# Altium project snes_hook.PrjPcb
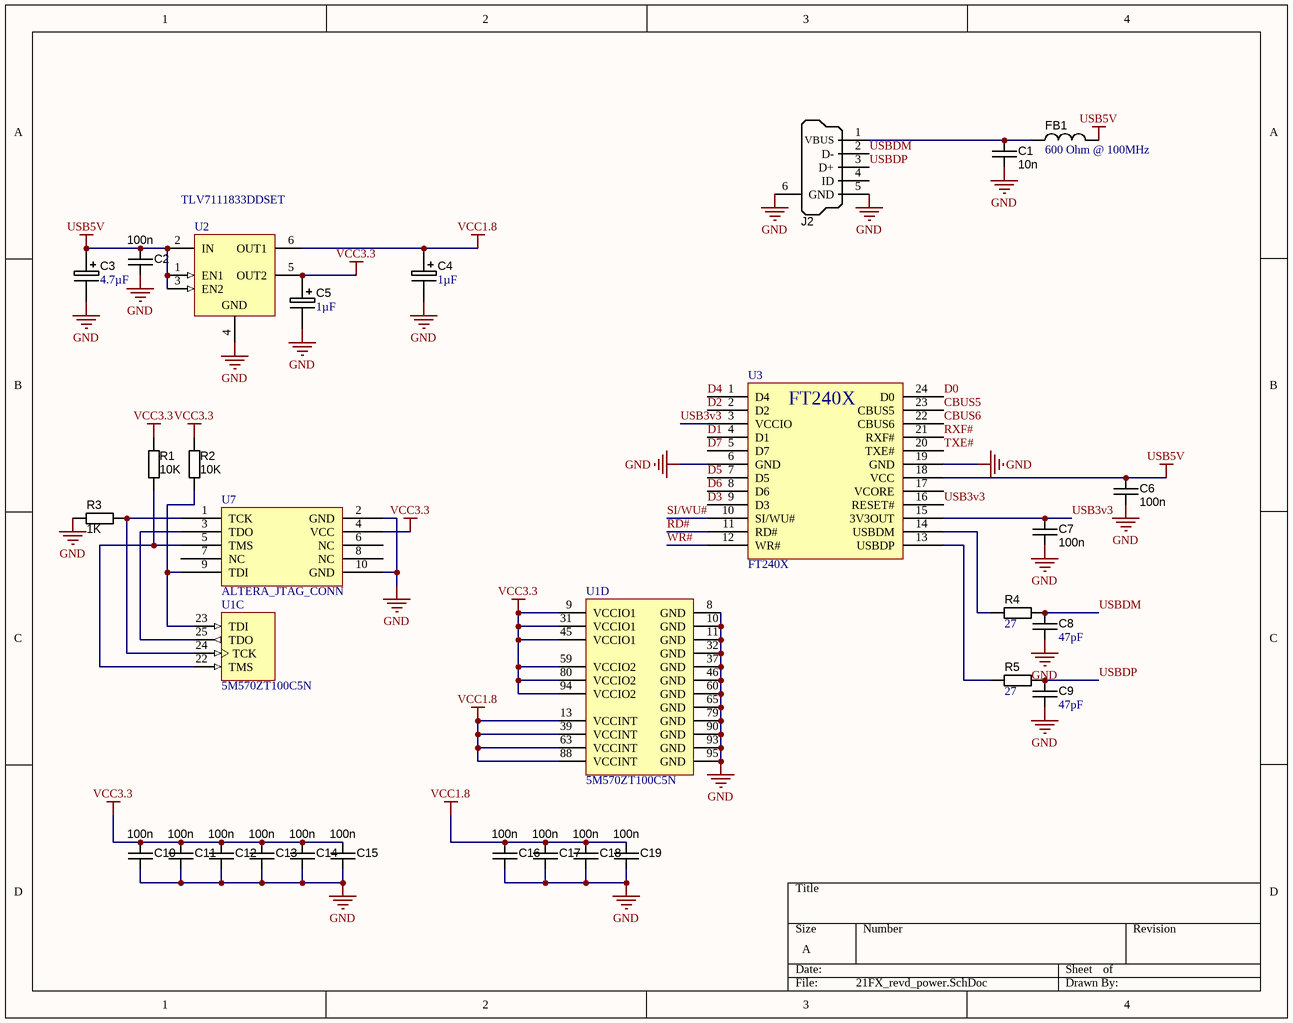
[diagram p0: 21FX_revd_power.SchDoc]
2 sheets, 44 parts. Net scope: global (net labels, ports and power ports of the same name join across sheets).
Board file: 21FX_revd.PcbDoc
Sheets:
  21FX_revd_power.SchDoc
  21FX_revd.SchDoc

## Sheet 21FX_revd_power.SchDoc
size A

### Parts
C1  value 10n  [CAPC1608X90N]  (hidden comment: approved sub OK)
C2  value 100n  [CAPC1608X90N]  (hidden comment: approved sub OK)
C3  Capacitance: 4.7µF  [CAPC1608X90N]
C4  Capacitance: 1µF  [CAPC1608X90N]
C5  Capacitance: 1µF  [CAPC1608X90N]
C6  value 100n  [CAPC1608X90N]  (hidden comment: approved sub OK)
C7  value 100n  [CAPC1608X90N]  (hidden comment: approved sub OK)
C8  Capacitance: 47pF  [CAPC1608X90N]
C9  Capacitance: 47pF  [CAPC1608X90N]
C10  value 100n  [CAPC1608X90N]  (hidden comment: approved sub OK)
C11  value 100n  [CAPC1608X90N]  (hidden comment: approved sub OK)
C12  value 100n  [CAPC1608X90N]  (hidden comment: approved sub OK)
C13  value 100n  [CAPC1608X90N]  (hidden comment: approved sub OK)
C14  value 100n  [CAPC1608X90N]  (hidden comment: approved sub OK)
C15  value 100n  [CAPC1608X90N]  (hidden comment: approved sub OK)
C16  value 100n  [CAPC1608X90N]  (hidden comment: approved sub OK)
C17  value 100n  [CAPC1608X90N]  (hidden comment: approved sub OK)
C18  value 100n  [CAPC1608X90N]  (hidden comment: approved sub OK)
C19  value 100n  [CAPC1608X90N]  (hidden comment: approved sub OK)
FB1  Impedance @ Frequency: 600 Ohm @ 100MHz  [FBC2012N]
J2  USB_Mini-B_TH  [USB_MINI-B_WURTH-TH]  (value not drawn)
R1  value 10K  [RESC1608X55N]  (hidden comment: Thick Film)
R2  value 10K  [RESC1608X55N]  (hidden comment: Thick Film)
R3  value 1K  [RESC1608X55N]  (hidden comment: Thick Film)
R4  Resistance (Ohms): 27  [RESC1608X55N]  (hidden comment: Thick Film)
R5  Resistance (Ohms): 27  [RESC1608X55N]  (hidden comment: Thick Film)
U1  5M570ZT100C5N  [TQFP100_A-120_N]  (parts C,D of 4)
U2  TLV7111833DDSET  [TI-DSE6_V]
U3  FT240X  [SSOP-24]
U7  ALTERA_JTAG_CONN  [JTAG_CONN]

### Nets
GND: C1.2 C2.2 C3.2 C4.2 C5.2 C6.2 C7.2 C8.2 C9.2 C10.2 C11.2 C12.2 C13.2 C14.2 C15.2 C16.2 C17.2 C18.2 C19.2 J2.5(GND) J2.6(Shell) R3.1 U1.8(GND) U1.10(GND) U1.11(GND) U1.32(GND) U1.37(GND) U1.46(GND) U1.60(GND) U1.65(GND) U1.79(GND) U1.90(GND) U1.93(GND) U1.95(GND) U2.4(GND) U3.6(GND) U3.19(GND) U7.2(GND) U7.10(GND)
USB5V: C2.1 C3.1 C6.1 FB1.2 U2.1(EN1) U2.2(IN) U2.3(EN2) U3.18(VCC)
VCC1.8: C4.1 C16.1 C17.1 C18.1 C19.1 U1.13(VCCINT) U1.39(VCCINT) U1.63(VCCINT) U1.88(VCCINT) U2.6(OUT1)
VCC3.3: C5.1 C10.1 C11.1 C12.1 C13.1 C14.1 C15.1 R1.1 R2.1 U1.9(VCCIO1) U1.31(VCCIO1) U1.45(VCCIO1) U1.59(VCCIO2) U1.80(VCCIO2) U1.94(VCCIO2) U2.5(OUT2) U7.4(VCC)
CBUS5: U3.23(CBUS5)
CBUS6: U3.22(CBUS6)
D0: U3.24(D0)
D1: U3.4(D1)
D2: U3.2(D2)
D3: U3.9(D3)
D4: U3.1(D4)
D5: U3.7(D5)
D6: U3.8(D6)
D7: U3.5(D7)
RD#: U3.11(RD#)
RXF#: U3.21(RXF#)
SI/WU#: U3.10(SI/WU#)
TXE#: U3.20(TXE#)
USB3v3: C7.1 U3.3(VCCIO) U3.15(3V3OUT) U3.16(RESET#)
USBDM: C8.1 J2.2(D-) R4.2
USBDP: C9.1 J2.3(D+) R5.2
WR#: U3.12(WR#)
NetC1_1: C1.1 FB1.1 J2.1(VBUS)
NetR1_2: R1.2 U1.22(TMS) U7.5(TMS)
NetR2_2: R2.2 U1.23(TDI) U7.9(TDI)
NetR3_2: R3.2 U1.24(TCK) U7.1(TCK)
NetR4_1: R4.1 U3.14(USBDM)
NetR5_1: R5.1 U3.13(USBDP)
NetU1_25: U1.25(TDO) U7.3(TDO)

Not connected (* = marked no-connect by the designer): J2 4(ID); U3 17(VCORE); U7 6(NC) 7(NC) 8(NC)

### Library data of the parts
C1 = CAPC_10n_0603_X7R_50V_10%: Capacitor SMD Cer 10nF 10% 50V X7R 0603; Manufacturer 1: TDK Corporation; Manufacturer Part Number 1: C1608X7R1H103K; Ratings: 50V; X7R; Material: ceramic; SCDType: spec; Package / Case: 0603 (1608 metric); Tolerance: ±10%; Supplier 1: Digi-Key; Supplier Part Number 1: 445-1311-1-ND; ComponentLink1URL: http://product.tdk.com/capacitor/mlcc/en/documents/mlcc_commercial_general_en.pdf; ComponentLink1Description: http://product.tdk.com/capacitor/mlcc/en/documents/mlcc_commercial_general_en.pdf; Supplier 2: Digi-Key; Supplier Part Number 2: 478-1227-1-ND; Manufacturer 2: AVX Corporation; Manufacturer Part Number 2: 06035C103KAT2A; ComponentLink2URL: http://www.avx.com/docs/Catalogs/cx7r.pdf; ComponentLink2Description: http://www.avx.com/docs/Catalogs/cx7r.pdf
C2 C6 C7 C10-C19 = CAPC_100n_0603_X7R_50V_10%: Capacitor SMD Cer 100nF 10% 50V X7R 0603; Manufacturer 1: AVX Corporation; Manufacturer Part Number 1: 06035C104KAT2A; Ratings: 50V; X7R; Material: ceramic; SCDType: spec; Manufacturer 2: TDK Corporation; Manufacturer Part Number 2: C1608X7R1H104K; Package / Case: 0603 (1608 Metric); Tolerance: ±10%; Supplier 1: Digi-Key; Supplier Part Number 1: 478-5052-1-ND; ComponentLink1URL: http://www.avx.com/docs/Catalogs/cx7r.pdf; ComponentLink1Description: http://www.avx.com/docs/Catalogs/cx7r.pdf; Supplier 2: Digi-Key; Supplier Part Number 2: 445-1314-1-ND; ComponentLink2URL: http://product.tdk.com/capacitor/mlcc/en/documents/mlcc_commercial_general_en.pdf; ComponentLink2Description: http://product.tdk.com/capacitor/mlcc/en/documents/mlcc_commercial_general_en.pdf
C3 = CAPT_4_7u_0603_10V: Capacitor SMD 4.7uF 10% 10V; Manufacturer: Yageo; Manufacturer Part Number: CC0603KRX5R6BB475; Temperature Coefficient: X5R; Supplier 1: Digi-Key; RoHS: RoHS Compliant; Category: Capacitors; Stock 1: 132000; Pricing 1: 4000=0.02154, 8000=0.02003, 12000=0.01903, 28000=0.01803, 100000=0.01365 (USD); Packaging: Tape & Reel (TR); Tolerance: ±10%; Voltage - Rated: 10V; Mounting Type: Surface Mount, MLCC; Operating Temperature: -55°C ~ 85°C; Applications: General Purpose; Ratings: -; Package / Case: 0603 (1608 Metric); Size / Dimension: 0.063" L x 0.031" W (1.60mm x 0.80mm); Height - Seated (Max): -; Thickness (Max): 0.035" (0.90mm); Lead Spacing: -; Features: -; Lead Style: -; ComponentLink1URL: http://www.yageo.com/documents/recent/UPY-GPHC_X5R_4V-to-50V-21.pdf; ComponentLink1Description: http://www.yageo.com/documents/recent/UPY-GPHC_X5R_4V-to-50V-21.pdf; Supplier Part Number 1: 311-1455-2-ND
C4 C5 = CAPT_1u_0603_10V: Capacitor SMD 1uF 10% 10V; Manufacturer: Murata Electronics North America; Manufacturer Part Number: GRM155R61A105KE15D; Temperature Coefficient: X5R; Supplier 1: Digi-Key; RoHS: RoHS Compliant; Category: Capacitors; Stock 1: 2730000; Pricing 1: 10000=0.0042, 20000=0.004, 30000=0.0038, 50000=0.0034, 100000=0.00275 (USD); Packaging: Tape & Reel (TR); Tolerance: ±10%; Voltage - Rated: 10V; Mounting Type: Surface Mount, MLCC; Operating Temperature: -55°C ~ 85°C; Applications: General Purpose; Ratings: -; Package / Case: 0402 (1005 Metric); Size / Dimension: 0.039" L x 0.020" W (1.00mm x 0.50mm); Height - Seated (Max): -; Thickness (Max): 0.022" (0.55mm); Lead Spacing: -; Features: -; Lead Style: -; ComponentLink1URL: http://www.murata.com/~/media/webrenewal/support/library/catalog/products/capacitor/mlcc/c02e.pdf; ComponentLink1Description: http://www.murata.com/~/media/webrenewal/support/library/catalog/products/capacitor/mlcc/c02e.pdf; Supplier Part Number 1: 490-3890-2-ND
C8 C9 = CAPC_47p_0603_X7R_50V_5%: Capacitor SMD Cer 47pF 5% 50V X7R 0603; Manufacturer 1: Samsung Electro-Mechanics America, Inc.; Manufacturer Part Number 1: CL10C470JB8NCNC; Description 1: CAP CER 47PF 50V NP0 0603; Temperature Coefficient: C0G, NP0; Supplier 1: Digi-Key; RoHS 1: RoHS Compliant; Category 1: Capacitors; Stock 1: 128540; Pricing 1: 1=0.1, 10=0.027, 25=0.0192, 50=0.0148, 100=0.0125, 500=0.00878, 1000=0.00684 (USD); Packaging: Cut Tape (CT); Tolerance: ±5%; Voltage - Rated: 50V; Mounting Type: Surface Mount, MLCC; Operating Temperature: -55°C ~ 125°C; Applications: General Purpose; Ratings: -; Package / Case: 0603 (1608 Metric); Size / Dimension: 0.063" L x 0.031" W (1.60mm x 0.80mm); Height - Seated (Max): -; Thickness (Max): 0.035" (0.90mm); Lead Spacing: -; Features: -; Lead Style: -; ComponentLink1URL: http://media.digikey.com/pdf/Data%20Sheets/Samsung%20PDFs/CL10C470JB8NCNC_Spec.pdf; ComponentLink1Description: http://media.digikey.com/pdf/Data%20Sheets/Samsung%20PDFs/CL10C470JB8NCNC_Spec.pdf; Supplier Part Number 1: 1276-2296-1-ND
FB1 = FERRITE_600-100MHz_0805: Ferrite bead 600 Ohm at 100 MHz 1.5A 0805 SMD; Manufacturer 1: Laird-Signal Integrity Products; Manufacturer Part Number 1: MI0805K601R-10; Description 1: FERRITE BEAD 600 OHM 0805; Category 1: Filters; Filter Type: Power Line; Number of Lines: 1; DC Resistance (DCR) (Max): 100 mOhm; Supplier 1: Digi-Key; RoHS 1: RoHS Compliant; Stock 1: 564000; Pricing 1: 4000=0.0225, 8000=0.021, 12000=0.0195, 28000=0.01928, 100000=0.01875 (USD); Packaging: Tape & Reel (TR); Current Rating (Max): 1.5A; Ratings: -; Operating Temperature: -40°C ~ 125°C; Package / Case: 0805 (2012 Metric); Mounting Type: Surface Mount; Height (Max): 0.043" (1.10mm); Size / Dimension: 0.079" L x 0.049" W (2.00mm x 1.25mm); ComponentLink1URL: http://media.digikey.com/pdf/Data%20Sheets/Steward%20PDFs/FerriteEMI_ChipBeads_br.pdf; ComponentLink1Description: http://media.digikey.com/pdf/Data%20Sheets/Steward%20PDFs/FerriteEMI_ChipBeads_br.pdf; Supplier Part Number 1: 240-2390-2-ND
J2 = USB_Mini-B_TH: Connector TH USB Type Mini-B; Manufacturer: Wurth Electronics Inc; Manufacturer Part Number: 651005136521; Connector Type: USB - mini B; Number of Contacts: 5; Gender: Receptacle; Supplier 1: Digi-Key; RoHS: RoHS Compliant; Category: Connectors, Interconnects; Stock 1: 3626; Pricing 1: 1=2.44, 10=2.113, 100=1.9906, 250=1.78752, 500=1.625 (USD); Packaging: Tube; Specifications: -; Mounting Type: Through Hole, Right Angle, Horizontal; Features: Board Guide, Shielded; Ingress Protection: -; ComponentLink1URL: http://katalog.we-online.de/em/datasheet/651005136521.pdf; ComponentLink1Description: http://katalog.we-online.de/em/datasheet/651005136521.pdf
R1 R2 = RES_10K_0603_5%: Resistor SMD chip 10k Ohm 0.1W 5% 0603; Manufacturer 1: Yageo; Manufacturer Part Number 1: RC0603JR-0710KL; Ratings: 1/10 W; SCDType: spec; Package / Case: 0603 (1608 metric); Tolerance: ±5%; Material: Thick Film; Supplier 1: Digi-Key; Supplier Part Number 1: 311-10KGRCT-ND; Supplier 2: Digi-Key; Supplier Part Number 2: 541-10KGCT-ND; Manufacturer 2: Vishay Dale; Manufacturer Part Number 2: CRCW060310K0JNEA; ComponentLink2URL: http://www.vishay.com/doc?20035; ComponentLink2Description: http://www.vishay.com/doc?20035; ComponentLink1URL: http://www.yageo.com/documents/recent/PYu-RC0603_51_RoHS_L_4.pdf; ComponentLink1Description: http://www.yageo.com/documents/recent/PYu-RC0603_51_RoHS_L_4.pdf
R3 = RES_1K_0603_5%: Resistor SMD chip 1k Ohm 0.1W 5% 0603; Manufacturer 1: Yageo; Manufacturer Part Number 1: RC0603JR-071KL; Ratings: 1/10 W; SCDType: spec; Package / Case: 0603 (1608 metric); Tolerance: ±5%; Material: Thick Film; Supplier 1: Digi-Key; Supplier Part Number 1: 311-1.0KGRCT-ND; Supplier 2: Digi-Key; Supplier Part Number 2: 541-1.0KGCT-ND; Manufacturer 2: Vishay Dale; Manufacturer Part Number 2: CRCW06031K00JNEA; ComponentLink2URL: http://www.vishay.com/doc?20008; ComponentLink2Description: http://www.vishay.com/doc?20008; ComponentLink1URL: http://www.yageo.com/documents/recent/PYu-RC0603_51_RoHS_L_4.pdf; ComponentLink1Description: http://www.yageo.com/documents/recent/PYu-RC0603_51_RoHS_L_4.pdf
R4 R5 = RES_27R_0603_5%: Resistor SMD chip 27 Ohm 0.1W 5% 0603; Description 2: RES SMD 27 OHM 5% 1/10W 0603; Power (Watts): 0.1W, 1/10W; Temperature Coefficient: ±100ppm/°C; Supplier 1: Digi-Key; Supplier 2: Digi-Key; Manufacturer 2: Yageo; Manufacturer Part Number 2: RC0603JR-0727RL; RoHS 2: RoHS Compliant; Category 2: Resistors; Stock 2: 134892; Pricing 2: 1=0.1, 10=0.011, 25=0.008, 100=0.0044, 250=0.00336, 500=0.0027, 1000=0.00198, 2500=0.00172 (USD); Packaging: Digi-Reel®; Tolerance: ±5%; Composition: Thick Film; Features: Moisture Resistant; Operating Temperature: -55°C ~ 155°C; Package / Case: 0603 (1608 Metric); Supplier Device Package: 0603; Size / Dimension: 0.063" L x 0.031" W (1.60mm x 0.80mm); Height: 0.022" (0.55mm); Number of Terminations: 2; ComponentLink1URL: http://www.yageo.com/NewPortal/yageodocoutput?fileName=/pdf/R-Chip/PYu-RC_Group_51_RoHS_L_3.pdf; ComponentLink1Description: http://www.yageo.com/NewPortal/yageodocoutput?fileName=/pdf/R-Chip/PYu-RC_Group_51_RoHS_L_3.pdf; Supplier Part Number 1: 311-27GRTR-ND; Supplier Part Number 2: 311-27GRDKR-ND
U1 = 5M570ZT100C5N: MAX V 1.8V CPLD, 74 IOs, 570 Logic Elements, 100-Pin TQFP, Commercial Temperature, Speed Grade 5, Pb-Free; DatasheetVersion: ver1.2, May-2011; PackageVersion: ver1.0, Jul-2011; PackageReference: TQFP100_A-120; PackageDescription: 100-Pin Plastic Thin Quad Flat Pack (TQFP) - Wire Bond - A:1.20; Code_JEDEC: MS-029-AED; ComponentLink1Description: Manufacturer URL; ComponentLink1URL: http://www.altera.com/; ComponentLink2Description: Datasheet; ComponentLink2URL: http://www.altera.com/literature/hb/max-v/max5_handbook.pdf; ComponentLink3Description: MAX V Device Pin-Out files; ComponentLink3URL: http://www.altera.com/literature/lit-dp.jsp?category=MAX%205&showspreadsheet=y; ComponentLink4Description: Package Specification; ComponentLink4URL: http://www.altera.com/devicepackaging/04R00365-01.pdf
U2 = TLV7111833DDSET: Dual Output High PSRR LDO, 200 mA, Fixed 1.8, 3.3 V Output, 2 to 5.5 V Input, 6-pin WSON (DSE), -40 to 125 degC, Green (RoHS & no Sb/Br); Manufacturer: Texas Instruments; Iout(Max)(A): 0.2; Iq(Typ)(mA): 0.03; SubFamily: Dual Channel LDO; Vdo(Typ)(mV): 150; Vin(Max)(V): 5.5; Vin(Min)(V): 2; DatasheetVersion: SBVS142A; PackageVersion: 4207810/A; PackageReference: DSE6; PackageDescription: 6-Pin Plastic Small Outline, Body 1.5 x 1.5 mm, Pitch 0.5 mm; Supplier 1: Digi-Key; Supplier Part Number 1: 296-29756-2-ND; Supplier 2: Digi-Key; Supplier Part Number 2: 296-29756-1-ND; Supplier 3: Digi-Key; Supplier Part Number 3: 296-29756-6-ND; Supplier 4: Farnell; Supplier Part Number 4: 2064246RL; Supplier 5: Farnell; Supplier Part Number 5: 2064246; Supplier 6: Mouser; Supplier Part Number 6: 595-TLV7111833DDSET; Eco-Plan: Green (RoHS & no Sb/Br); Fixed Output Options(V): 1.8, 3.3; Mounting Technology: Surface Mount; PartNumber: TLV7111833DDSET; ComponentLink1Description: Manufacturer URL; ComponentLink1URL: http://www.ti.com/; ComponentLink2Description: Datasheet; ComponentLink2URL: http://www.ti.com/general/docs/lit/getliterature.tsp?genericPartNumber=TLV7111833D&fileType=pdf; ComponentLink3Description: Package Specification; ComponentLink3URL: http://www.ti.com/litv/pdf/mpds287

## Sheet 21FX_revd.SchDoc
size A
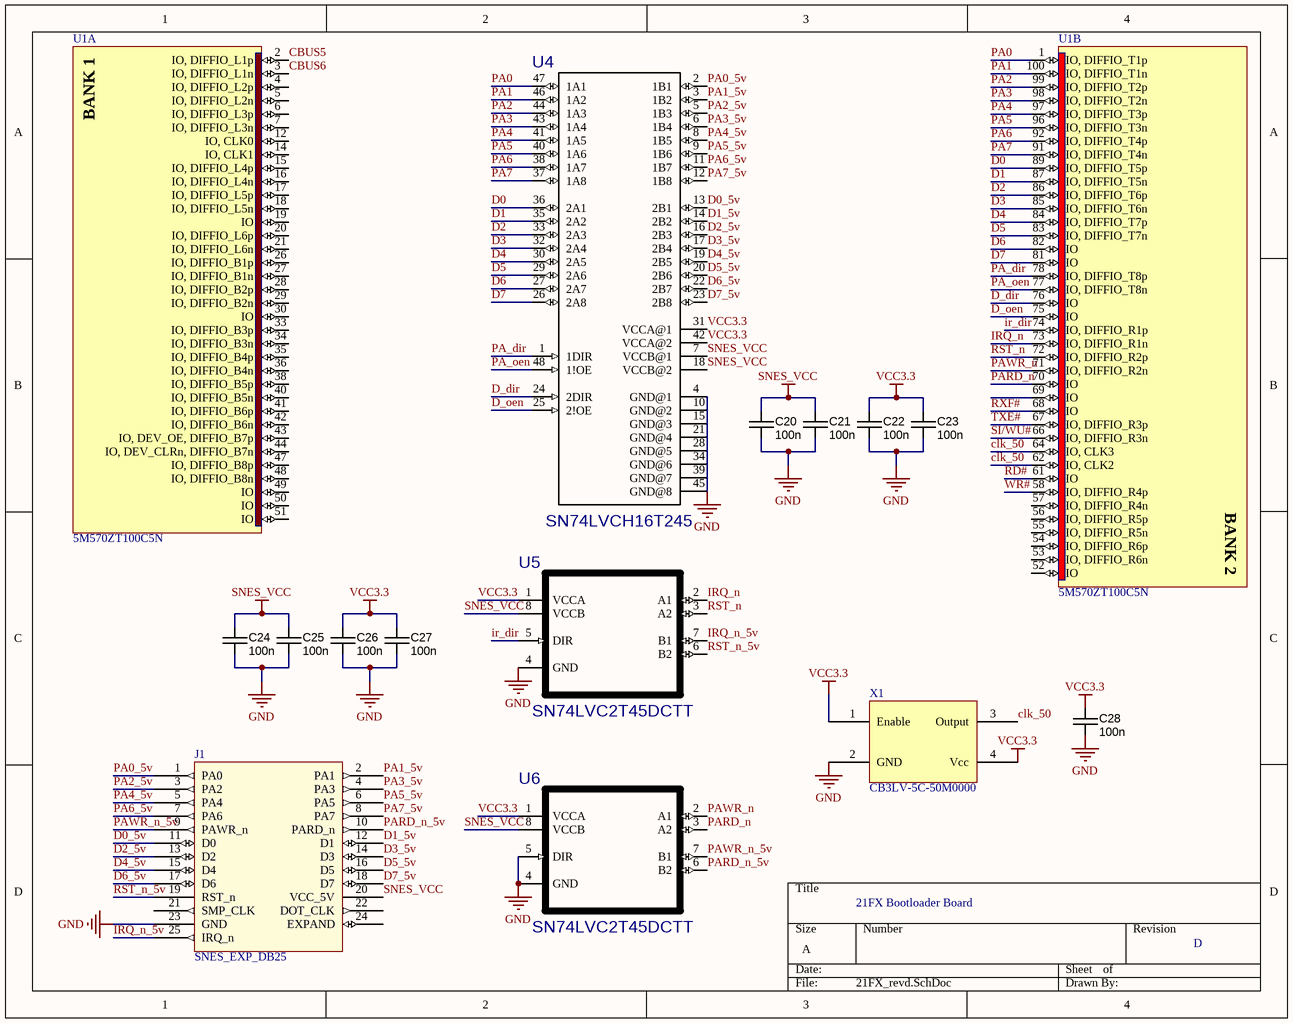
[diagram p1: 21FX_revd.SchDoc]

### Parts
C20  value 100n  [CAPC1608X90N]  (hidden comment: approved sub OK)
C21  value 100n  [CAPC1608X90N]  (hidden comment: approved sub OK)
C22  value 100n  [CAPC1608X90N]  (hidden comment: approved sub OK)
C23  value 100n  [CAPC1608X90N]  (hidden comment: approved sub OK)
C24  value 100n  [CAPC1608X90N]  (hidden comment: approved sub OK)
C25  value 100n  [CAPC1608X90N]  (hidden comment: approved sub OK)
C26  value 100n  [CAPC1608X90N]  (hidden comment: approved sub OK)
C27  value 100n  [CAPC1608X90N]  (hidden comment: approved sub OK)
C28  value 100n  [CAPC1608X90N]  (hidden comment: approved sub OK)
J1  SNES_EXP_DB25  [DB-25_RA_MPLUG]
U1  5M570ZT100C5N  [TQFP100_A-120_N]  (parts A,B of 4)
U4  SN74LVCH16T245  [TSSOP48]
U5  SN74LVC2T45DCTT  [SOP65P400X130-8N]
U6  SN74LVC2T45DCTT  [SOP65P400X130-8N]
X1  Manufacturer Part Number: CB3LV-5C-50M0000  [OSCILLATOR_7x5]  (hidden comment: CTX1282CT-ND)

### Nets
GND: C20.2 C21.2 C22.2 C23.2 C24.2 C25.2 C26.2 C27.2 C28.2 J1.23(GND) U4.4(GND@1) U4.10(GND@2) U4.15(GND@3) U4.21(GND@4) U4.28(GND@5) U4.34(GND@6) U4.39(GND@7) U4.45(GND@8) U5.4(GND) U6.4(GND) U6.5(DIR) X1.2(GND)
SNES_VCC: C20.1 C21.1 C24.1 C25.1 J1.20(VCC_5V) U4.7(VCCB@1) U4.18(VCCB@2) U5.8(VCCB) U6.8(VCCB)
VCC3.3: C22.1 C23.1 C26.1 C27.1 C28.1 U4.31(VCCA@1) U4.42(VCCA@2) U5.1(VCCA) U6.1(VCCA) X1.1(Enable) X1.4(Vcc)
CBUS5: U1.2(IO,_DIFFIO_L1p)
CBUS6: U1.3(IO,_DIFFIO_L1n)
clk_50: U1.62(IO,_CLK2) U1.64(IO,_CLK3) X1.3(Output)
D0: U1.89(IO,_DIFFIO_T5p) U4.36(2A1)
D0_5v: J1.11(D0) U4.13(2B1)
D1: U1.87(IO,_DIFFIO_T5n) U4.35(2A2)
D1_5v: J1.12(D1) U4.14(2B2)
D2: U1.86(IO,_DIFFIO_T6p) U4.33(2A3)
D2_5v: J1.13(D2) U4.16(2B3)
D3: U1.85(IO,_DIFFIO_T6n) U4.32(2A4)
D3_5v: J1.14(D3) U4.17(2B4)
D4: U1.84(IO,_DIFFIO_T7p) U4.30(2A5)
D4_5v: J1.15(D4) U4.19(2B5)
D5: U1.83(IO,_DIFFIO_T7n) U4.29(2A6)
D5_5v: J1.16(D5) U4.20(2B6)
D6: U1.82(IO) U4.27(2A7)
D6_5v: J1.17(D6) U4.22(2B7)
D7: U1.81(IO) U4.26(2A8)
D7_5v: J1.18(D7) U4.23(2B8)
D_dir: U1.76(IO) U4.24(2DIR)
D_oen: U1.75(IO) U4.25(2!OE)
ir_dir: U1.74(IO,_DIFFIO_R1p) U5.5(DIR)
IRQ_n: U1.73(IO,_DIFFIO_R1n) U5.2(A1)
IRQ_n_5v: J1.25(IRQ_n) U5.7(B1)
PA0: U1.1(IO,_DIFFIO_T1p) U4.47(1A1)
PA0_5v: J1.1(PA0) U4.2(1B1)
PA1: U1.100(IO,_DIFFIO_T1n) U4.46(1A2)
PA1_5v: J1.2(PA1) U4.3(1B2)
PA2: U1.99(IO,_DIFFIO_T2p) U4.44(1A3)
PA2_5v: J1.3(PA2) U4.5(1B3)
PA3: U1.98(IO,_DIFFIO_T2n) U4.43(1A4)
PA3_5v: J1.4(PA3) U4.6(1B4)
PA4: U1.97(IO,_DIFFIO_T3p) U4.41(1A5)
PA4_5v: J1.5(PA4) U4.8(1B5)
PA5: U1.96(IO,_DIFFIO_T3n) U4.40(1A6)
PA5_5v: J1.6(PA5) U4.9(1B6)
PA6: U1.92(IO,_DIFFIO_T4p) U4.38(1A7)
PA6_5v: J1.7(PA6) U4.11(1B7)
PA7: U1.91(IO,_DIFFIO_T4n) U4.37(1A8)
PA7_5v: J1.8(PA7) U4.12(1B8)
PA_dir: U1.78(IO,_DIFFIO_T8p) U4.1(1DIR)
PA_oen: U1.77(IO,_DIFFIO_T8n) U4.48(1!OE)
PARD_n: U1.70(IO) U6.3(A2)
PARD_n_5v: J1.10(PARD_n) U6.6(B2)
PAWR_n: U1.71(IO,_DIFFIO_R2n) U6.2(A1)
PAWR_n_5v: J1.9(PAWR_n) U6.7(B1)
RD#: U1.61(IO)
RST_n: U1.72(IO,_DIFFIO_R2p) U5.3(A2)
RST_n_5v: J1.19(RST_n) U5.6(B2)
RXF#: U1.68(IO)
SI/WU#: U1.66(IO,_DIFFIO_R3n)
TXE#: U1.67(IO,_DIFFIO_R3p)
WR#: U1.58(IO,_DIFFIO_R4p)

Not connected (* = marked no-connect by the designer): J1 21(SMP_CLK) 22(DOT_CLK) 24(EXPAND); U1 4(IO,_DIFFIO_L2p) 5(IO,_DIFFIO_L2n) 6(IO,_DIFFIO_L3p) 7(IO,_DIFFIO_L3n) 12(IO,_CLK0) 14(IO,_CLK1) 15(IO,_DIFFIO_L4p) 16(IO,_DIFFIO_L4n) 17(IO,_DIFFIO_L5p) 18(IO,_DIFFIO_L5n) 19(IO) 20(IO,_DIFFIO_L6p) 21(IO,_DIFFIO_L6n) 26(IO,_DIFFIO_B1p) 27(IO,_DIFFIO_B1n) 28(IO,_DIFFIO_B2p) 29(IO,_DIFFIO_B2n) 30(IO) 33(IO,_DIFFIO_B3p) 34(IO,_DIFFIO_B3n) 35(IO,_DIFFIO_B4p) 36(IO,_DIFFIO_B4n) 38(IO,_DIFFIO_B5p) 40(IO,_DIFFIO_B5n) 41(IO,_DIFFIO_B6p) 42(IO,_DIFFIO_B6n) 43(IO,_DEV_OE,_DIFFIO_B7p) 44(IO,_DEV_CLRn,_DIFFIO_B7n) 47(IO,_DIFFIO_B8p) 48(IO,_DIFFIO_B8n) 49(IO) 50(IO) 51(IO) 52(IO) 53(IO,_DIFFIO_R6n) 54(IO,_DIFFIO_R6p) 55(IO,_DIFFIO_R5n) 56(IO,_DIFFIO_R5p) 57(IO,_DIFFIO_R4n) 69(IO)

### Notes on the sheet
- 21FX Bootloader Board
- D
- (in symbol 5M570ZT100C5N, part A) BANK 1
- (in symbol 5M570ZT100C5N, part B) BANK 2

### Library data of the parts
C20-C28 = CAPC_100n_0603_X7R_50V_10%: as C2 on sheet 21FX_revd_power; Manufacturer 2: TDK Corporation; Manufacturer Part Number 2: C1608X7R1H104K; Package / Case: 0603 (1608 Metric); Tolerance: ±10%; Supplier 1: Digi-Key; Supplier Part Number 1: 478-5052-1-ND; ComponentLink1URL: http://www.avx.com/docs/Catalogs/cx7r.pdf; ComponentLink1Description: http://www.avx.com/docs/Catalogs/cx7r.pdf; Supplier 2: Digi-Key; Supplier Part Number 2: 445-1314-1-ND; ComponentLink2URL: http://product.tdk.com/capacitor/mlcc/en/documents/mlcc_commercial_general_en.pdf; ComponentLink2Description: http://product.tdk.com/capacitor/mlcc/en/documents/mlcc_commercial_general_en.pdf
U1 = 5M570ZT100C5N: as U1 on sheet 21FX_revd_power; DatasheetVersion: ver1.2, May-2011; PackageVersion: ver1.0, Jul-2011; PackageReference: TQFP100_A-120; PackageDescription: 100-Pin Plastic Thin Quad Flat Pack (TQFP) - Wire Bond - A:1.20; Code_JEDEC: MS-029-AED; ComponentLink1Description: Manufacturer URL; ComponentLink1URL: http://www.altera.com/; ComponentLink2Description: Datasheet; ComponentLink2URL: http://www.altera.com/literature/hb/max-v/max5_handbook.pdf; ComponentLink3Description: MAX V Device Pin-Out files; ComponentLink3URL: http://www.altera.com/literature/lit-dp.jsp?category=MAX%205&showspreadsheet=y; ComponentLink4Description: Package Specification; ComponentLink4URL: http://www.altera.com/devicepackaging/04R00365-01.pdf
X1 = CTX1282CT-ND_50MHz: 50 MHz 3.3v Oscillator; Manufacturer: CTS-Frequency Controls; Frequency: 50MHz; Function: Tri-State (Output Enable); Output: HCMOS, TTL; Frequency Stability: ±25ppm; Current - Supply (Max): 40mA; Current - Supply (Disable) (Max): 10µA; Supplier 1: Digi-Key; RoHS: RoHS Compliant; Category: Crystals and Oscillators; Stock 1: 628; Pricing 1: 1=1.43, 10=1.374, 50=1.3436, 100=1.1491, 500=1.11872 (USD); Packaging: Cut Tape (CT); Type: XO (Standard); Voltage - Supply: 3.3V; Operating Temperature: -20°C ~ 70°C; Ratings: -; Mounting Type: Surface Mount; Size / Dimension: 0.276" L x 0.197" W (7.00mm x 5.00mm); Height: 0.071" (1.80mm); Package / Case: 4-SMD, No Lead (DFN, LCC); ComponentLink1URL: http://www.ctscorp.com/wp-content/uploads/2015/11/008-0256-0.pdf; ComponentLink1Description: http://www.ctscorp.com/wp-content/uploads/2015/11/008-0256-0.pdf; Supplier Part Number 1: CTX1282CT-ND
U4 = SN74LVCH16T245: Value: *
U5 U6 = SN74LVC2T45DCTT: Value: *

## Nets that join several sheets
GND: 21FX_revd_power (39 pins), 21FX_revd (22 pins)
VCC3.3: 21FX_revd_power (17 pins), 21FX_revd (11 pins)
CBUS5: 21FX_revd_power (U3.23), 21FX_revd (U1.2)
CBUS6: 21FX_revd_power (U3.22), 21FX_revd (U1.3)
D0: 21FX_revd_power (U3.24), 21FX_revd (U1.89 U4.36)
D1: 21FX_revd_power (U3.4), 21FX_revd (U1.87 U4.35)
D2: 21FX_revd_power (U3.2), 21FX_revd (U1.86 U4.33)
D3: 21FX_revd_power (U3.9), 21FX_revd (U1.85 U4.32)
D4: 21FX_revd_power (U3.1), 21FX_revd (U1.84 U4.30)
D5: 21FX_revd_power (U3.7), 21FX_revd (U1.83 U4.29)
D6: 21FX_revd_power (U3.8), 21FX_revd (U1.82 U4.27)
D7: 21FX_revd_power (U3.5), 21FX_revd (U1.81 U4.26)
RD#: 21FX_revd_power (U3.11), 21FX_revd (U1.61)
RXF#: 21FX_revd_power (U3.21), 21FX_revd (U1.68)
SI/WU#: 21FX_revd_power (U3.10), 21FX_revd (U1.66)
TXE#: 21FX_revd_power (U3.20), 21FX_revd (U1.67)
WR#: 21FX_revd_power (U3.12), 21FX_revd (U1.58)